# EAGLE design BzBrd_1_0_0 (EAGLE 7.6.0)
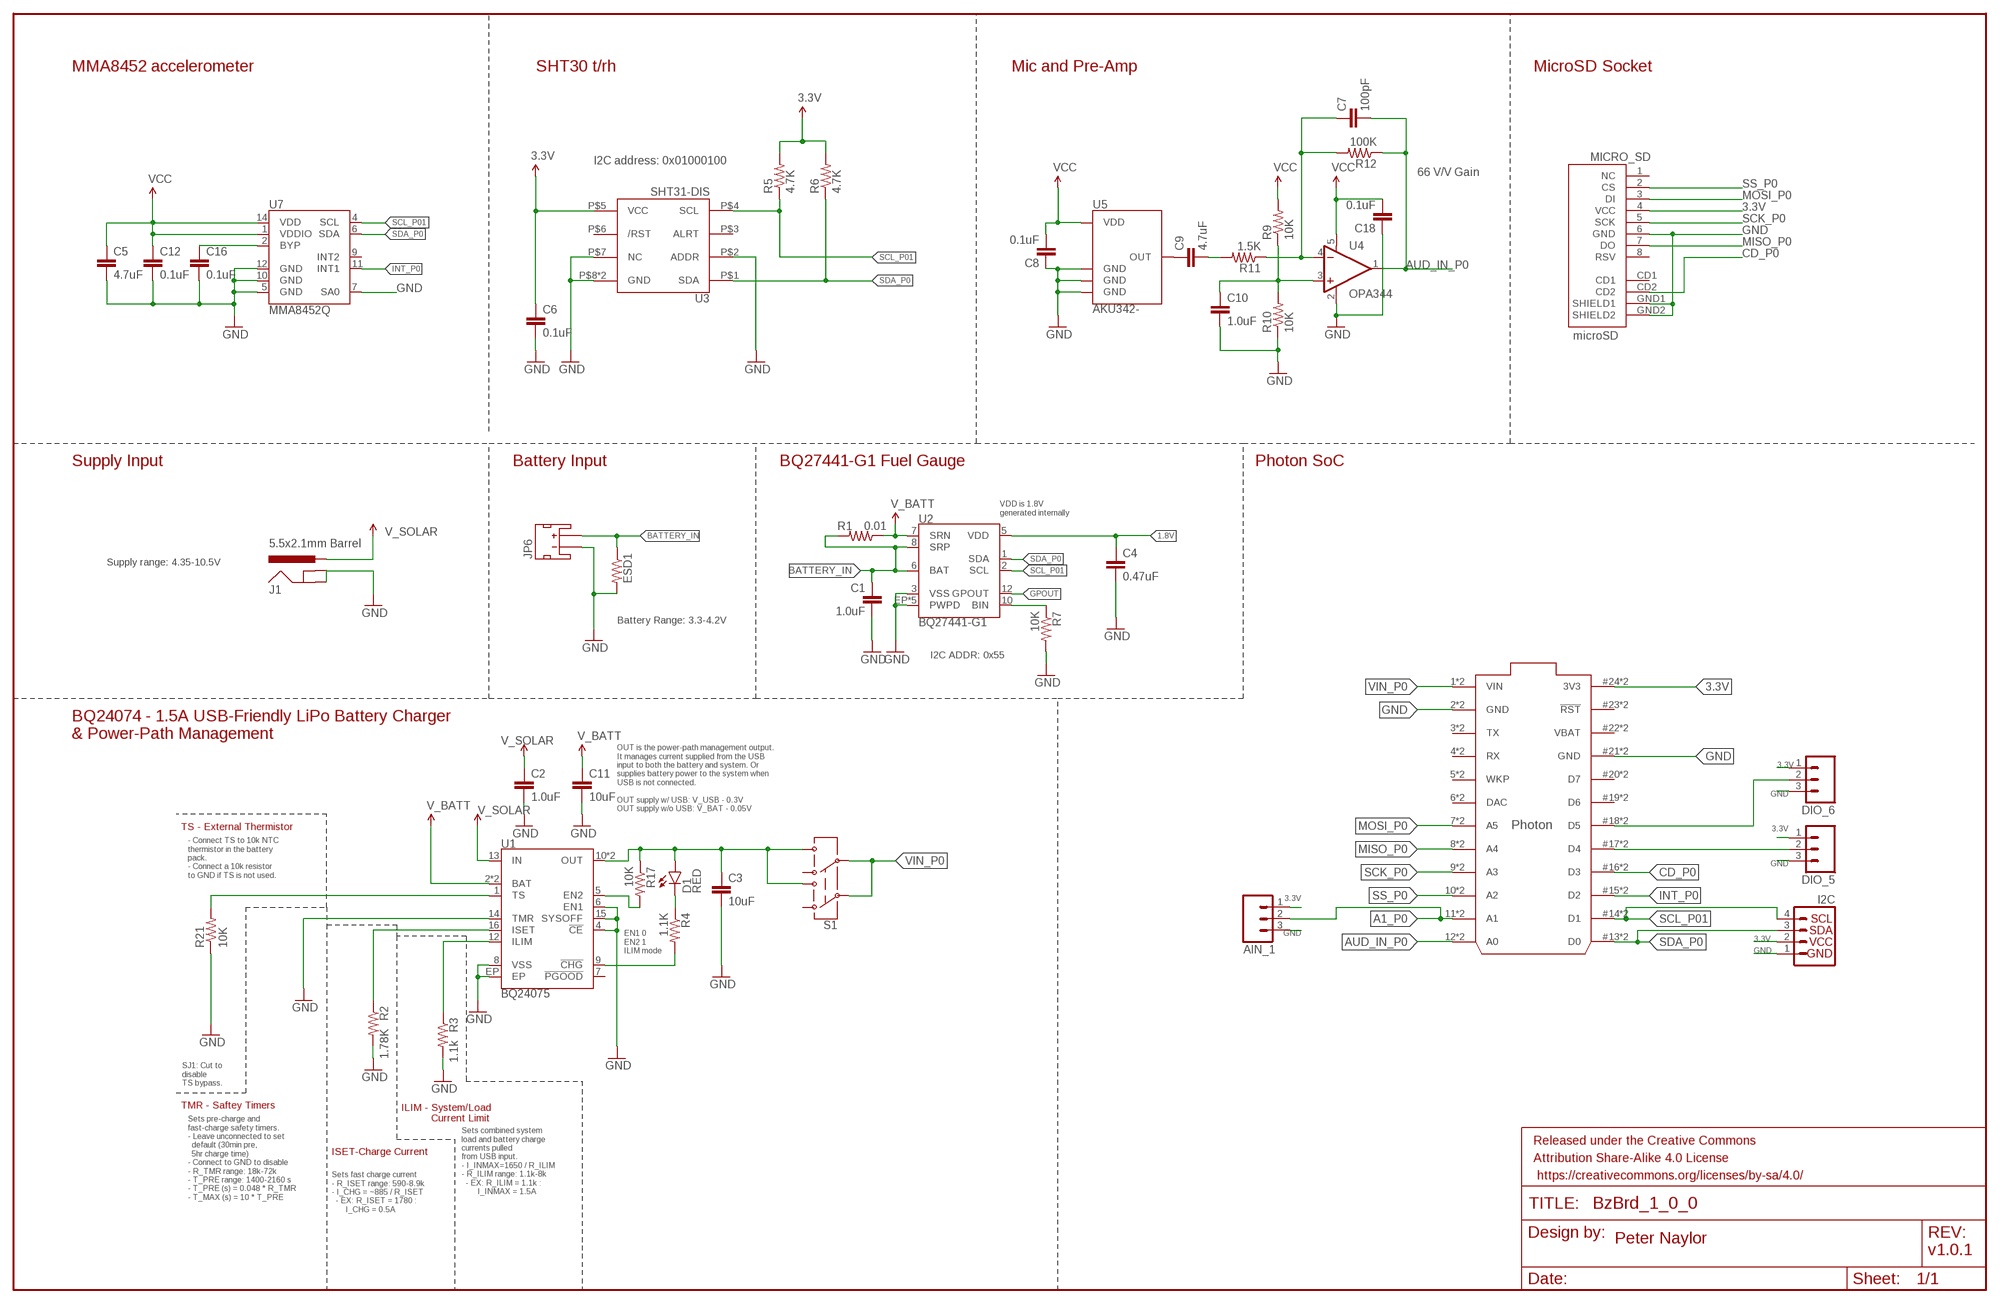
[diagram p0: schematic, sheet 1]

## Parts
AIN_1  M03LOCK_LONGPADS  [1X03_LOCK_LONGPADS]
C1  1.0uF  1.0UF-16V-10%(0603)  [0603-CAP]
C2  1.0uF  1.0UF50V10%(1206)  [1206-CAP]
C3  10uF  10UF10V10%(0805)  [0805-CAP]
C4  0.47uF  CAP0603-CAP  [0603-CAP]
C5  4.7uF  CAP0603-CAP  [0603-CAP]
C6  0.1uF  0.1UF-25V-5%(0603)  [0603-CAP]
C7  100pF  CAP0402-CAP  [0402-CAP]
C8  0.1uF  CAP0402-CAP  [0402-CAP]
C9  4.7uF  4.7UF-6.3V-10%(0603)0603  [0603-CAP]
C10  1.0uF  4.7UF-6.3V-10%(0603)0603  [0603-CAP]
C11  10uF  10UF10V10%(0805)  [0805-CAP]
C12  0.1uF  CAP0603-CAP  [0603-CAP]
C16  0.1uF  CAP0603-CAP  [0603-CAP]
C18  0.1uF  CAP0402-CAP  [0402-CAP]
D1  RED  LED-BLUE0603  [LED-0603]
DIO_5  M03LOCK_LONGPADS  [1X03_LOCK_LONGPADS]
DIO_6  M03LOCK_LONGPADS  [1X03_LOCK_LONGPADS]
ESD1  R-US_R0201  [R0201]
FRAME1  FRAME-LEDGER  [CREATIVE_COMMONS]
I2C  I2C_STANDARD  [1X04]
J1  5.5x2.1mm Barrel  POWER_JACKSMD  [POWER_JACK_SMD]
JP6  JST_2MM_MALE  [JST-2-SMD]
MICRO_SD  microSD  USD-SOCKETSMD  [MICRO-SD-SOCKET-PP]
R1  0.01  RESISTOR1206  [1206]
R2  1.78K  RESISTOR0603-RES  [0603-RES]
R3  1.1k  RESISTOR0603-RES  [0603-RES]
R4  1.1K  180OHM1/10W1%(0603)  [0603-RES]
R5  4.7K  4.7KOHM-1/10W-1%(0603)  [0603-RES]
R6  4.7K  4.7KOHM-1/10W-1%(0603)  [0603-RES]
R7  10K  10KOHM-1/10W-1%(0603)0603  [0603-RES]
R9  10K  RESISTOR0402-RES  [0402-RES]
R10  10K  RESISTOR0402-RES  [0402-RES]
R11  1.5K  RESISTOR0402-RES  [0402-RES]
R12  100K  RESISTOR0402-RES  [0402-RES]
R17  10K  10KOHM-1/10W-1%(0603)0603  [0603-RES]
R21  10K  10KOHM-1/10W-1%(0603)0603  [0603-RES]
S1  SWITCH-DPDT  [JCQN]
U1  BQ24075  [PVQFN-N16]
U2  BQ27441-G1  [PDSO-N12]
U3  SHT31-DIS  [SHT3X]
U4  OPA344  [SOT23-5]
U5  AKU342-  [AKU342-]
U7  MMA8452Q  [QFN-16_0.5MM]
U$1  PHOTON_WITH_STACKABLE_HEADERS  [PHOTON_STACKABLE]

## Nets
1.8V: C4.1 U2.5(VDD)
3.3V: AIN_1.1 C5.1 C6.1 C8.2 C12.1 C18.2 DIO_5.1 DIO_6.1 I2C.2 MICRO_SD.4(VCC) R5.2 R6.2 R9.2 U3.P$5(VCC) U4.5(V+) U5.4(VDD) U7.1(VDDIO) U7.14(VDD) U$1.24(3V3) U$1.#24(3V3) ; supply symbol labelled VCC
!CHG!: R4.2 U1.9(!CHG!)
A1_P0: AIN_1.2 U$1.11(A1) U$1.@11(A1)
AUD_IN_P0: C7.2 R12.1 U4.1(OUT) U$1.12(A0) U$1.@12(A0)
BATTERY_IN: C1.1 ESD1.1 JP6.2(+) R1.2 U2.6(BAT) U2.8(SRP)
CD_P0: MICRO_SD.CD2 U$1.16(D3) U$1.#16(D3)
GND: AIN_1.3 C1.2 C2.2 C3.2 C4.2 C5.2 C6.2 C8.1 C10.2 C11.2 C12.2 C16.2 C18.1 DIO_5.3 DIO_6.3 ESD1.2 I2C.1 J1.GND(GNDBREAK) J1.P$4(GND) JP6.1(-) MICRO_SD.6(GND) MICRO_SD.GND1(SHIELD1) MICRO_SD.GND2(SHIELD2) R2.2 R3.2 R7.2 R10.1 R21.1 U1.4(!CE!) U1.6(EN1) U1.8(VSS) U1.14(TMR) U1.15(SYSOFF) U1.EP U2.3(VSS) U2.EP1(PWPD) U2.EP2(PWPD) U2.EP3(PWPD) U2.EP4(PWPD) U2.EP(PWPD) U3.P$2(ADDR) U3.P$7(NC) U3.P$8(GND) U3.PAD(GND) U4.2(V-) U5.2(GND) U5.3(GND) U5.5(GND) U7.5(GND) U7.7(SA0) U7.10(GND) U7.12(GND) U$1.2(GND) U$1.21(GND) U$1.#21(GND) U$1.@2(GND)
GPOUT: U2.12(GPOUT)
ILIM: R3.1 U1.12(ILIM)
INT_P0: U7.11(INT1) U$1.15(D2) U$1.#15(D2)
ISET: R2.1 U1.16(ISET)
MISO_P0: MICRO_SD.7(DO) U$1.8(A4) U$1.@8(A4)
MOSI_P0: MICRO_SD.3(DI) U$1.7(A5) U$1.@7(A5)
N$1: D1.C R4.1
N$3: R7.1 U2.10(BIN)
N$6: R17.2 U1.5(EN2)
N$7: C16.1 U7.2(BYP)
N$9: C9.1 U5.1(OUT)
N$10: C7.1 R11.1 R12.2 U4.4(-IN)
N$11: C9.2 R11.2
N$12: C10.1 R9.1 R10.2 U4.3(+IN)
N$13: DIO_5.2 U$1.17(D4) U$1.#17(D4)
N$20: DIO_6.2 U$1.18(D5) U$1.#18(D5)
SCK_P0: MICRO_SD.5(SCK) U$1.9(A3) U$1.@9(A3)
SCL_P01: I2C.4 R5.1 U2.2(SCL) U3.P$4(SCL) U7.4(SCL) U$1.14(D1) U$1.#14(D1)
SDA_P0: I2C.3 R6.1 U2.1(SDA) U3.P$1(SDA) U7.6(SDA) U$1.13(D0) U$1.#13(D0)
SS_P0: MICRO_SD.2(CS) U$1.10(A2) U$1.@10(A2)
TS: R21.2 U1.1(TS)
V_BATT: C11.1 R1.1 U1.2(BAT) U1.3(BAT) U2.7(SRN)
V_SOLAR: C2.1 J1.VIN0(PWR) U1.13(IN) ; supply symbol labelled V_USB
VIN_P0: S1.P$2 S1.P$5 U$1.1(VIN) U$1.@1(VIN)
VOUT_SOL: C3.1 D1.A R17.1 S1.P$3 S1.P$6 U1.10(OUT) U1.11(OUT)
Unconnected: JP6.NC1(PAD1) JP6.NC2(PAD2) MICRO_SD.1(NC) MICRO_SD.8(RSV) MICRO_SD.CD1 S1.P$1 S1.P$4 U1.7(!PGOOD!) U3.P$3(ALRT) U3.P$6(/RST) U7.9(INT2) U$1.3(TX) U$1.4(RX) U$1.5(WKP) U$1.6(DAC) U$1.19(D6) U$1.20(D7) U$1.23(!RST) U$1.#19(D6) U$1.#20(D7) U$1.#23(!RST) U$1.@3(TX) U$1.@4(RX) U$1.@5(WKP) U$1.@6(DAC)

## Notes on the sheet
- MMA8452 accelerometer | SHT30 t/rh | Mic and Pre-Amp | MicroSD Socket
- I2C address: 0x01000100
- 66 V/V Gain
- Supply Input | Battery Input | BQ27441-G1 Fuel Gauge | Photon SoC
- VDD is 1.8V
  generated internally
- Supply range: 4.35-10.5V
- Battery Range: 3.3-4.2V
- I2C ADDR: 0x55
- BQ24074 - 1.5A USB-Friendly LiPo Battery Charger 
  & Power-Path Management
- OUT is the power-path management output.
  It manages current supplied from the USB 
  input to both the battery and system. Or
  supplies battery power to the system when 
  USB is not connected.
  
  OUT supply w/ USB: V_USB - 0.3V
  OUT supply w/o USB: V_BAT - 0.05V
- TS - External Thermistor
- - Connect TS to 10k NTC 
  thermistor in the battery
  pack.
  - Connect a 10k resistor 
  to GND if TS is not used.
- EN1 0
  EN2 1
  ILIM mode
- SJ1: Cut to 
  disable
  TS bypass.
- TMR - Saftey Timers
- ILIM - System/Load 
            Current Limit
- Sets pre-charge and
  fast-charge safety timers.
  - Leave unconnected to set
    default (30min pre, 
    5hr charge time)
  - Connect to GND to disable
  - R_TMR range: 18k-72k
  - T_PRE range: 1400-2160 s
  - T_PRE (s) = 0.048 * R_TMR
  - T_MAX (s) = 10 * T_PRE
- Sets combined system
  load and battery charge 
  currents pulled
  from USB input.
  - I_INMAX=1650 / R_ILIM
  - R_ILIM range: 1.1k-8k
    - EX: R_ILIM = 1.1k : 
          I_INMAX = 1.5A
- ISET-Charge Current
- Sets fast charge current
  - R_ISET range: 590-8.9k
  - I_CHG = ~885 / R_ISET
    - EX: R_ISET = 1780 : 
         I_CHG = 0.5A
- Peter Naylor
- v1.0.1

## Power pins joined to a net without a drawn wire
VBAT: U$1.22(VBAT) U$1.#22(VBAT)

## Library data of the parts
AIN_1 DIO_5 DIO_6 = SparkFun-Connectors:M03: Header 3 Standard 3-pin 0.1" header. Use with straight break away headers (SKU : PRT-00116), right angle break away headers (PRT-00553), swiss pins (PRT-00743), machine pins (PRT-00117), and female headers (PRT-00115). Molex polarized connector foot print use with SKU : PRT-08232 with associated crimp pins and housings.
C1 = SparkFun-Capacitors:1.0UF-16V-10%(0603): CAP-00868; PROD_ID: CAP-00868
C2 = SparkFun-Capacitors:1.0UF50V10%(1206): CAP-09822; PROD_ID: CAP-09822
C3 C11 = SparkFun-Capacitors:10UF10V10%(0805): CAP-11330; PROD_ID: CAP-11330
C4 = SparkFun-Capacitors:CAP: Capacitor Standard 0603 ceramic capacitor, and 0.1" leaded capacitor.; PROD_ID: CAP-13216
C5 = SparkFun-Passives:CAP: Capacitor Standard 0603 ceramic capacitor, and 0.1" leaded capacitor.
C6 = SparkFun-Capacitors:0.1UF-25V-5%(0603): CAP-08604; PROD_ID: CAP-08604
C7 C8 C12 C16 C18 = SparkFun:CAP: Capacitor Standard 0603 ceramic capacitor, and 0.1" leaded capacitor.
C9 = SparkFun-Capacitors:4.7UF-6.3V-10%(0603): CAP-08280; PROD_ID: CAP-08280
C10 = SparkFun-Capacitors:4.7UF-6.3V-10%(0603): CAP-08280; PROD_ID: CAP-08280; VALUE: 4.7uF
D1 = SparkFun-LED:LED-BLUE: Blue LEDs for production use Various blue LEDs stocked by SparkFun production 0603 - DIO-08575 Rebel - DIO-09553 1206 - DIO-09911; PROD_ID: DIO-08575; VALUE: BLUE
ESD1 = resistor:R-US_: RESISTOR, American symbol
FRAME1 = SparkFun-Aesthetics:FRAME-LEDGER: Schematic Frame Standard 11x14 US Ledger frame
I2C = SparkFun-Connectors:I2C_STANDARD: SparkFun has standardized on a pinout for all I2C based sensor breakouts. This pinout allows I2C boards to be plugged directly into the headers on Arduino Uno compatible boards, and to be daisy chained easily.
J1 = SparkFun-Connectors:POWER_JACK: Power Jack This is the standard 5.5mm barrel jack for power. The PTH is the most common, proven, reliable, footprint. The Slot footprint only works if the mill layer is transmitted to the PCB fab house so be warned. Mating wall wart : TOL-00298 (and others); PROD_ID: CONN-08106; SF_ID: PRT-12748
JP6 = SparkFun-Connectors:JST_2MM_MALE: Mates to single-cell LiPo batteries. CONN-11443 Now with smashable polarity marks!; BTM_NEG: -; BTM_POS: +; PROD_ID: CONN-11443; TOP_NEG: -; TOP_POS: +
MICRO_SD = SparkFun:USD-SOCKET: microSD Socket Push-push type uSD socket. Schematic element and footprint production proven. Spark Fun Electronics SKU : PRT-00127. tDoc lines correctly indicate media card edge positions when inserting (unlocked, locked, depressed).
R1 = SparkFun-Resistors:RESISTOR: Resistor; PROD_ID: RES-13218
R2 = SparkFun-Passives:RESISTOR: Resistor; PROD_ID: RES-13217
R3 = SparkFun-Passives:RESISTOR: Resistor; PROD_ID: RES-10447
R4 = SparkFun-Resistors:180OHM1/10W1%(0603): RES-08788; PROD_ID: RES-08788; VALUE: 180
R5 R6 = SparkFun-Resistors:4.7KOHM-1/10W-1%(0603): RES-07857; PROD_ID: RES-07857
R7 R17 R21 = SparkFun-Resistors:10KOHM-1/10W-1%(0603): RES-00824; PROD_ID: RES-00824
R9-R12 = SparkFun:RESISTOR: Resistor
S1 = SparkFun-Electromechanical:SWITCH-DPDT: DPDT Version of the COM-00597
U1 = battery-management-temp:BQ24075; PROD_ID: IC-13219
U2 = battery-management-temp:BQ27441-G1; PROD_ID: IC-13220
U3 = thomasb9511:SHT31-DIS
U4 = SparkFun:OPA344
U5 = SparkFun-Sensors:AKU342-: Omnidirection bottom-port MEMS microphone
U7 = SparkFun-Sensors:MMA8452Q: MMA8452Q 3-Axis, 12/8-bit Digital Accelerometer Supply Voltage: 1.6-3.6V Range: +/- 2g, 4g, 8g Interface: I2C, 12-bit and 8-bit ODR: 1.56 Hz - 800 Hz Package: QFN-16 http://cache.freescale.com/files/sensors/doc/data_sheet/MMA8452Q.pdf; PROD_ID: IC-10769
U$1 = Particle-Devices:PHOTON: Particle Photon Wi-Fi through-hole development board footprint

## Board
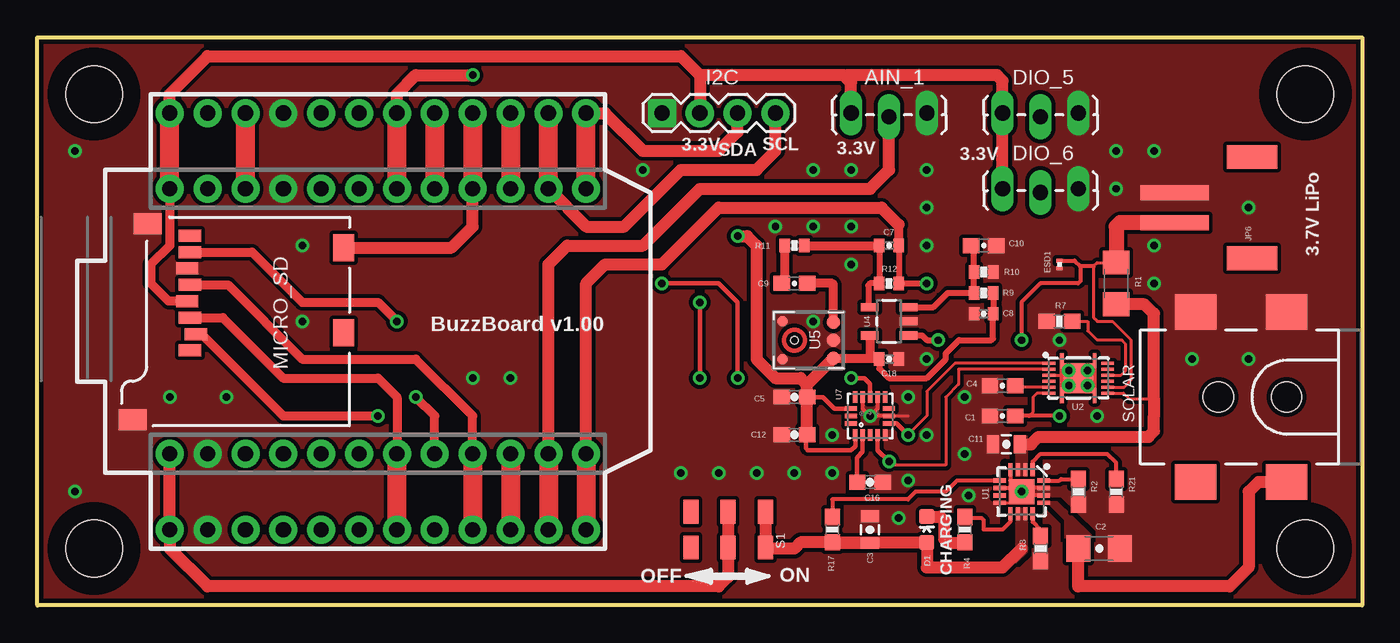
[diagram p1: board, top side]
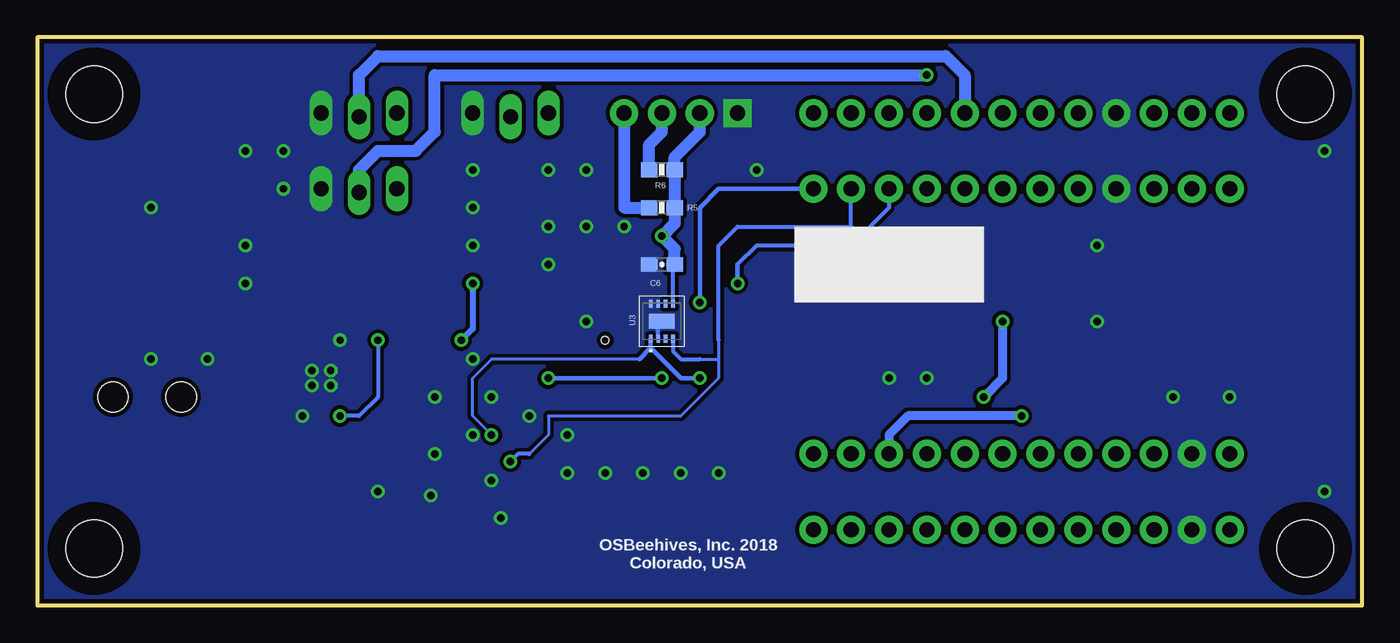
[diagram p2: board, bottom side, seen from below]

Size 88.9 x 38.1 mm. Coordinates in mm from the lower left corner, seen from the top.
Outline: 0,38.1 88.9,38.1 88.9,0 0,0 0,38.1
Copper layers (1*16): Top 0.035mm / dielectric 1.5mm / Bottom 0.035mm
Design rules "default *": minimum track width 8mil, minimum drill 0.0005mm, track to track 7mil, track to pad 7mil, pad to pad 7mil, via to via 7mil, smd to smd 0mil, copper to edge 12mil, drill to drill 10mil, minimum pad ring 10mil, minimum via ring 8mil, stop-mask expansion 4mil, vias tented up to drill 0mil, thermal gap 8mil

### Footprints (pad centres in the part's own frame; a part is rotated, then mirrored left to right if it is on the bottom)
1X03_LOCK_LONGPADS = drill 1.016 long: 1 0,0; 2 2.54,-0.254; 3 5.08,0
0603-CAP = smd 1.1 x 1: 1 -0.85,0; 2 0.85,0
1206-CAP = smd 1.6 x 1.8: 1 -1.4,0; 2 1.4,0
0805-CAP = smd 0.8 x 1.2: 1 -0.9,0; 2 0.9,0
0402-CAP = smd 0.7 x 0.9: 1 -0.65,0; 2 0.65,0
LED-0603 = smd 1 x 1: A 0,-0.877; C 0,0.877
R0201 = smd 0.28 x 0.43: 1 -0.255,0; 2 0.255,0
1X04 = drill 1.016 pad 1.88 square: 1 0,0 | drill 1.016 pad 1.88: 2 2.54,0; 3 5.08,0; 4 7.62,0
POWER_JACK_SMD = smd 2.8 x 2.4: GND 0,-5.7; P$4 6.1,-5.7; VIN0 0,5.7; VIN1 6.1,5.7 | hole 2.032: 0,0; 4.572,0
JST-2-SMD = smd 1 x 4.6: 1 -1,-3.7; 2 1,-3.7 | smd 1.6 x 3.4: NC1 -3.4,1.5; NC2 3.4,1.5
MICRO-SD-SOCKET-PP = smd 0.8 x 1.5: 1 -8.94,10.7; 2 -7.84,10.3; 3 -6.74,10.7; 4 -5.64,10.9; 5 -4.54,10.7; 6 -3.44,10.9; 7 -2.34,10.7; 8 -1.24,10.7 | smd 1.8 x 1.4: CD1 -7.75,0.4; CD2 -2.05,0.4 | smd 1.4 x 1.9: GND1 -13.6,14.55; GND2 -0.45,13.55
1206 = smd 1.6 x 1.8: 1 -1.4,0; 2 1.4,0
0603-RES = smd 1.1 x 1: 1 -0.85,0; 2 0.85,0
0402-RES = smd 0.7 x 0.9: 1 -0.65,0; 2 0.65,0
JCQN = smd 1 x 1.6: P$1 -2.5,1.2; P$2 0,1.2; P$3 2.5,1.2; P$4 -2.5,-1.2; P$5 0,-1.2; P$6 2.5,-1.2
PVQFN-N16 = smd 0.28 x 0.85: 1 -0.75,-1.475; 2 -0.25,-1.475; 3 0.25,-1.475; 4 0.75,-1.475; 9 0.75,1.475; 10 0.25,1.475; 11 -0.25,1.475; 12 -0.75,1.475 | smd 0.85 x 0.28: 5 1.475,-0.75; 6 1.475,-0.25; 7 1.475,0.25; 8 1.475,0.75; 13 -1.475,0.75; 14 -1.475,0.25; 15 -1.475,-0.25; 16 -1.475,-0.75 | smd 1.7 x 1.7: EP 0,0
PDSO-N12 = smd 0.2 x 0.85: 1 -1,-1.975; 2 -0.6,-1.975; 3 -0.2,-1.975; 4 0.2,-1.975; 5 0.6,-1.975; 6 1,-1.975; 7 1,1.975; 8 0.6,1.975; 9 0.2,1.975; 10 -0.2,1.975; 11 -0.6,1.975; 12 -1,1.975 | smd 1.95 x 1.95: EP 0,0 | smd 1 x 0.25: EP1 -1.15,1.1; EP2 -1.15,-1.1; EP3 1.15,-1.1; EP4 1.15,1.1
SHT3X = smd 0.55 x 0.25: P$1 -1.175,0.75; P$2 -1.175,0.25; P$3 -1.175,-0.25; P$4 -1.175,-0.75; P$5 1.175,-0.75; P$6 1.175,-0.25; P$7 1.175,0.25; P$8 1.175,0.75 | smd 1 x 1.7: PAD 0,0
SOT23-5 = smd 0.55 x 1.2: 1 -0.95,-1.3; 2 0,-1.3; 3 0.95,-1.3; 4 0.95,1.3; 5 -0.95,1.3
AKU342- = smd 0.9 x 0.9: 1 -1.2,2.62; 4 1.2,2.62; 5 0,2.62 | smd 0.7 x 0.7: 2 -1.27,-0.79; 3 1.27,-0.79 | hole 0.5: 0,0
QFN-16_0.5MM = smd 0.8 x 0.3: 1 -1.275,1; 2 -1.275,0.5; 3 -1.275,0; 4 -1.275,-0.5; 5 -1.275,-1; 9 1.275,-1; 10 1.275,-0.5; 11 1.275,0; 12 1.275,0.5; 13 1.275,1 | smd 0.3 x 0.8: 6 -0.5,-1.275; 7 0,-1.275; 8 0.5,-1.275; 14 0.5,1.275; 15 0,1.275; 16 -0.5,1.275
PHOTON_STACKABLE = drill 1.016 pad 1.88: 1 1.27,33.02; 2 1.27,30.48; 3 1.27,27.94; 4 1.27,25.4; 5 1.27,22.86; 6 1.27,20.32; 7 1.27,17.78; 8 1.27,15.24; 9 1.27,12.7; 10 1.27,10.16; 11 1.27,7.62; 12 1.27,5.08; 13 19.05,5.08; 14 19.05,7.62; 15 19.05,10.16; 16 19.05,12.7; 17 19.05,15.24; 18 19.05,17.78; 19 19.05,20.32; 20 19.05,22.86; 21 19.05,25.4; 22 19.05,27.94; 23 19.05,30.48; 24 19.05,33.02; #13 24.13,5.08; #14 24.13,7.62; #15 24.13,10.16; #16 24.13,12.7; #17 24.13,15.24; #18 24.13,17.78; #19 24.13,20.32; #20 24.13,22.86; #21 24.13,25.4; #22 24.13,27.94; #23 24.13,30.48; #24 24.13,33.02; @1 -3.81,33.02; @2 -3.81,30.48; @3 -3.81,27.94; @4 -3.81,25.4; @5 -3.81,22.86; @6 -3.81,20.32; @7 -3.81,17.78; @8 -3.81,15.24; @9 -3.81,12.7; @10 -3.81,10.16; @11 -3.81,7.62; @12 -3.81,5.08
STAND-OFF = hole 3.797: 0,0

### Placement (x,y rotation side)
AIN_1  54.61,33.02 0 top
C1  64.77,12.7 180 top
C2  71.25,3.81 0 top
C3  55.88,5.08 90 top
C4  64.77,14.73 180 top
C5  50.8,13.97 180 top
C6  46.99,22.86 180 bottom
C7  57.15,24.13 0 top
C8  63.5,19.56 0 top
C9  50.8,21.59 180 top
C10  63.5,24.13 0 top
C11  65.02,10.79 180 top
C12  50.8,11.43 180 top
C16  55.88,8.26 0 top
C18  57.15,16.51 180 top
D1  59.69,5.08 0 top
DIO_5  64.77,33.02 0 top
DIO_6  64.77,27.94 0 top
ESD1  68.58,22.86 270 top
FRAME1  -87.63,-8.89 0 top  (outside the outline)
I2C  41.91,33.02 0 top
J1  83.82,13.97 180 top
JP6  80.01,26.67 270 top
MICRO_SD  20.95,26.04 90 top
R1  72.39,21.59 90 top
R2  69.85,7.62 270 top
R3  67.31,3.81 270 top
R4  62.23,5.08 90 top
R5  46.99,26.67 0 bottom
R6  46.99,29.21 0 bottom
R7  68.58,19.05 180 top
R9  63.5,20.95 0 top
R10  63.5,22.35 180 top
R11  50.8,24.13 180 top
R12  57.15,21.59 180 top
R17  53.34,5.08 90 top
R21  72.39,7.62 90 top
S1  46.35,5.08 0 top
U1  66.04,7.62 180 top
U2  69.85,15.24 270 top
U3  46.99,19.05 90 bottom
U4  57.15,19.05 90 top
U5  50.8,17.78 270 top
U7  55.88,12.7 90 top
U$1  41.91,8.89 90 top
U$2  [STAND-OFF]  3.81,34.29 270 top
U$3  [STAND-OFF]  3.81,3.81 270 top
U$4  [STAND-OFF]  85.09,34.29 270 top
U$5  [STAND-OFF]  85.09,3.81 270 top

### Tracks (layer width: path | path; a pad name or v marks a point on that pad's centre or on a via)
1.8V
  Top 0.203: U2.5 65.71,14.64 C4.1
3.3V  (via drill 0.5)
  Top 0.305: U7.14 53.48,13.2 52.7,13.97 C5.1 | U7.1 54.88,10.68 54.61,10.41 51.69,10.41 51.56,10.54 51.56,11.34 C12.1
  Top 0.406: 55.88,18.07 U4.5 | R9.2 C8.2 64.14,19.54 64.14,17.91 64.01,17.78 61.85,17.78 60.96,16.89 60.96,16.51 59.69,15.24 57.15,15.24 56.5,15.89 C18.2
  Top 0.61: U$1.24 8.89,24.13 7.62,22.86 7.62,21.59 8.81,20.39 MICRO_SD.4 | U5.4 55.88,16.58 | 55.88,16.58 56.43,16.58 C18.2 | 55.88,18.07 55.88,16.58
  Top 0.813: 51.69,11.39 C12.1 C5.1 51.65,14.81 | 51.65,14.81 U5.4 | AIN_1.1 54.61,35.05 54.23,35.43 | 54.23,35.43 54.1,35.56 44.45,35.56 | 54.23,35.43 54.36,35.56 64.39,35.56 64.77,35.18 DIO_5.1 DIO_6.1 | v46.99,24.77 47.62,24.77 48.26,24.13 48.26,16.51 49.53,15.24 51.22,15.24 51.65,14.81 | U$1.#24 8.89,34.29 11.43,36.83 43.18,36.83 44.45,35.56 | 44.45,35.56 I2C.2
  Top 1.27: U$1.24 U$1.#24
  Bottom 0.254: U3.P$5 46.24,22.76 C6.1
  Bottom 0.813: I2C.2 44.45,31.75 46.14,30.06 R6.2 R5.2 46.14,25.61 v46.99,24.77 46.14,23.91 C6.1
!CHG!
  Top 0.254: U1.9 65.29,5.6 64.77,5.08 63.5,5.08 63.5,5.71 63.37,5.84 62.32,5.84 R4.2
A1_P0
  Top 0.813: U$1.11 34.29,22.86 35.56,24.13 40.64,24.13 44.45,27.94 55.88,27.94 57.15,29.21 AIN_1.2
  Top 1.27: U$1.11 U$1.@11
AUD_IN_P0  (via drill 0.5)
  Top 0.406: C7.2 R12.1 v59.69,21.59 | U4.1 59.37,18.1 59.69,17.78 v60.45,17.78
  Top 0.61: C7.2 57.8,25.51 57.78,25.53
  Top 0.813: U$1.12 36.83,21.59 38.1,22.86 41.91,22.86 45.72,26.67 56.64,26.67 57.78,25.53
  Top 1.27: U$1.12 U$1.@12
  Bottom 0.406: v59.69,21.59 59.69,18.54 v60.45,17.78
BATTERY_IN  (via drill 0.5)
  Top 0.203: U2.8 72.93,14.64 73.41,15.11 73.41,17.78 72.14,19.05 71.12,19.05 70.87,19.3 70.87,22.73 71.12,22.99 R1.2 | U2.6 67.07,14.24 66.8,13.97 66.8,12.95 66.55,12.7
  Top 0.254: 70.87,22.73 69.98,22.73 | 69.98,22.73 69.98,21.72 69.85,21.59 67.31,21.59 66.04,20.32 v66.04,17.78 | 66.55,12.7 C1.1 v68.58,12.7 | ESD1.1 69.59,23.11 69.98,22.73
  Top 1.016: JP6.2 72.66,25.67 72.39,25.4 R1.2
  Bottom 0.254: v66.04,17.78 66.04,13.97 67.31,12.7 v68.58,12.7
CD_P0
  Top 0.813: MICRO_SD.CD2 27.8,23.98 29.21,25.4 U$1.16
  Top 1.27: U$1.#16 U$1.16
GND  (via drill 0.5)
  Top 0.203: U7.7 58.42,12.7 | U2.3 68.91,15.44 v69.22,15.75 | U1.8 65.29,6.87 U1.EP
  Top 0.254: U1.6 65.79,7.87 U1.EP | U1.4 65.29,8.37 U1.EP | U1.15 66.29,7.87 U1.EP | U1.14 66.29,7.37 U1.EP | U7.10 56.38,13.2 v55.88,12.7 | U7.12 55.38,13.2 v55.88,12.7 | U7.7 v55.88,12.7
  Bottom 0.254: U3.P$2 47.24,18.8 U3.PAD
  other vias: 62.23,10.16 62.48,7.37 66.04,7.62 57.78,5.84 62.23,13.97 54.61,22.86 52.07,19.05 53.34,11.43 53.34,8.89 50.8,8.89 48.26,8.89 45.72,8.89 43.18,8.89 54.61,25.4 52.07,25.4 49.53,25.4 40.64,29.21 52.07,29.21 54.61,29.21 59.69,29.21 59.69,26.67 31.75,15.24 29.21,15.24 12.7,13.97 8.89,13.97 17.78,24.13 2.54,30.48 2.54,7.62 70.48,15.75 70.48,14.73 69.22,14.73 72.39,30.48 74.93,30.48 72.39,27.94 74.93,24.13 74.93,21.59 81.28,26.67 77.47,16.51 81.28,16.51 68.58,17.78 71.12,12.7 59.69,24.13 58.42,13.97 59.69,16.51 59.69,11.43 58.42,8.38 17.78,19.05
  pour Bottom (isolate 0.254, rank 6, no thermals): 0,38.1 0,0 88.9,0 88.9,38.1
  pour Top (isolate 0.254, rank 6, no thermals): 0,38.1 0,0 88.9,0 88.9,38.1
ILIM
  Top 0.254: U1.12 66.79,5.6 67.31,5.08 R3.1
INT_P0  (via drill 0.5)
  Top 0.305: U7.11 55.88,14.86 55.5,15.24 v54.61,15.24 | v41.91,21.59 45.72,21.59 46.99,20.32 v46.99,15.24
  Top 1.27: U$1.#15 U$1.15
  Bottom 0.254: U$1.15 31.75,26.67 33.02,25.4 33.02,24.13 40.64,24.13 41.91,22.86
  Bottom 0.305: v54.61,15.24 v46.99,15.24 | 41.91,22.86 v41.91,21.59
ISET
  Top 0.254: U1.16 68.59,8.37 68.68,8.46 69.84,8.46 R2.1
MISO_P0  (via drill 0.5)
  Top 0.61: U$1.8 26.67,12.7 v25.4,13.97 | MICRO_SD.7 14.4,23.7 17.78,20.32 22.86,20.32 v24.13,19.05
  Bottom 0.61: v24.13,19.05 24.13,15.24 v25.4,13.97
MOSI_P0
  Top 0.61: MICRO_SD.3 12.46,19.3 16.51,15.24 22.86,15.24 24.13,13.97 U$1.7
  Top 1.27: U$1.@7 U$1.7
N$1
  Top 0.813: D1.C 60.59,5.96 60.83,5.71 60.83,4.45 61.09,4.19 62.19,4.19 R4.1
N$3
  Top 0.203: U2.10 72.72,15.44 73.03,15.75 73.03,17.53 72.77,17.78 71.12,17.78 70.48,18.41 70.48,19.05 R7.1
N$6
  Top 0.254: R17.2 53.34,7.11 58.42,7.11 58.93,7.62 60.96,7.62 61.71,8.37 U1.5
N$7
  Top 0.305: U7.2 55.38,10.29 54.99,9.91 54.99,8.93 C16.1
N$9
  Top 0.61: U5.1 53.42,21.51 53.34,21.59 C9.1
N$10
  Top 0.406: C7.1 R12.2 55.88,21.59 55.75,21.46 55.75,20.1 U4.4
  Top 0.61: R11.1 C7.1
N$11
  Top 0.61: R11.2 50.15,21.79 C9.2
N$12
  Top 0.406: C10.1 62.85,23.93 R10.2 R9.1 61.09,20.95 60.13,20 U4.3
N$13
  Top 1.27: U$1.#17 U$1.17
  Bottom 0.813: DIO_5.2 67.31,35.56 66.04,36.83 27.94,36.83 26.67,35.56 U$1.#17
N$20  (via drill 0.5)
  Top 0.813: U$1.#18 24.13,34.29 25.4,35.56 v29.21,35.56
  Top 1.27: U$1.18 U$1.#18
  Bottom 0.813: DIO_6.2 67.31,29.21 66.04,30.48 63.5,30.48 62.23,31.75 62.23,35.56 v29.21,35.56
SCK_P0
  Top 0.61: U$1.9 29.21,12.7 25.4,16.51 17.78,16.51 12.79,21.5 MICRO_SD.5
  Top 1.27: U$1.9 U$1.@9
SCL_P01  (via drill 0.5)
  Top 0.203: U2.2 61.81,15.84 61.81,14.82 60.96,13.97 60.96,9.4 57.4,9.4 v57.15,9.65 | U7.4
  Top 0.305: U7.4 56.39,10.41 v57.15,9.65
  Top 0.813: U$1.14 36.83,25.4 39.37,25.4 43.18,29.21 48.26,29.21 49.53,30.48 I2C.4
  Top 1.27: U$1.14 U$1.#14
  Bottom 0.203: 43.18,17.78 43.18,16.51 | 43.18,16.51 43.18,15.24 45.72,12.7 54.61,12.7 54.61,11.43 55.88,10.16 | 44.45,16.51 43.18,16.51
  Bottom 0.254: U3.P$4 46.24,17.03 45.72,16.51 44.45,16.51 | 43.18,17.78 43.18,24.13 41.91,25.4 34.29,25.4 U$1.14 | 55.88,10.16 56.64,10.16 v57.15,9.65
  Bottom 0.813: I2C.4 49.53,26.67 R5.1
SDA_P0  (via drill 0.5)
  Top 0.203: U2.1 61.58,16.24 59.69,14.35 59.69,12.7 v58.42,11.43
  Top 0.305: v44.45,15.24 v44.45,20.32 | U7.6 57.65,12.2 v58.42,11.43
  Top 0.813: U$1.#13 38.1,33.02 40.64,30.48 45.72,30.48 46.99,31.75 I2C.3
  Top 1.27: U$1.13 U$1.#13
  Bottom 0.203: v58.42,11.43 59.69,12.7 59.69,15.24 58.42,16.51 48.49,16.51
  Bottom 0.305: U3.P$1 47.74,17.26 | 47.74,17.26 45.72,15.24 v44.45,15.24 | v44.45,20.32 44.45,26.67 43.18,27.94 U$1.13 | 48.49,16.51 47.74,17.26
  Bottom 0.813: R6.1 47.84,30.9 46.99,31.75 I2C.3
SS_P0  (via drill 0.5)
  Top 0.61: MICRO_SD.2 11.02,18.2 16.51,12.7 v22.86,12.7
  Top 1.27: U$1.10 U$1.@10
  Bottom 0.61: v22.86,12.7 30.48,12.7 31.75,11.43 U$1.10
TS
  Top 0.254: U1.1 66.79,9.64 67.31,10.16 71.78,10.16 72.39,9.55 R21.2
V_BATT
  Top 0.203: U2.7 72.88,14.24 73.28,13.84 74.93,13.84
  Top 0.813: C11.1 66.67,10.79 67.18,11.3 74.55,11.3 74.93,11.68 74.93,12.7 74.93,13.84 74.93,19.56 74.3,20.19 R1.1
  pour Top (no thermals): 66.42,8.66 65.66,8.66 65.66,10.19 65.53,10.19 65.53,11.38 66.42,11.38
V_SOLAR
  Top 0.813: J1.VIN0 81.93,8.27 81.28,7.62 81.28,2.54 80.01,1.27 69.85,1.27 C2.1
  pour Top (no thermals): 67.11,6.99 68.43,6.99 69.42,5.99 70.74,4.72 70.74,4.5 68.96,4.5 68.96,5.71 67.92,6.76 67.11,6.76
VBAT
  Top 1.27: U$1.22 U$1.#22
VIN_P0
  Top 0.813: S1.P$2 S1.P$5 46.35,1.91 45.72,1.27 11.43,1.27 8.89,3.81 U$1.@1 U$1.1
VOUT_SOL
  Top 0.813: S1.P$3 S1.P$6 48.92,3.81 50.8,3.81 51.22,4.23 R17.1 | R17.1 53.37,4.2 D1.A 59.69,2.54 64.77,2.54 66.04,3.81 | C3.1 53.39,4.18 R17.1
  pour Top (no thermals): 66.42,6.55 66.42,3.56 65.66,2.82 65.66,6.55

### Text on the board
tPlace: 3.3V | SDA | SCL | 3.3V | 3.3V | 3.7V LiPo | CHARGING | OFF | ON
tNames: BuzzBoard v1.00 | SOLAR
bNames: OSBeehives, Inc. 2018 / Colorado, USA